# EAGLE design Arduino-Pro-Mini-xkid (EAGLE 7.2.0)
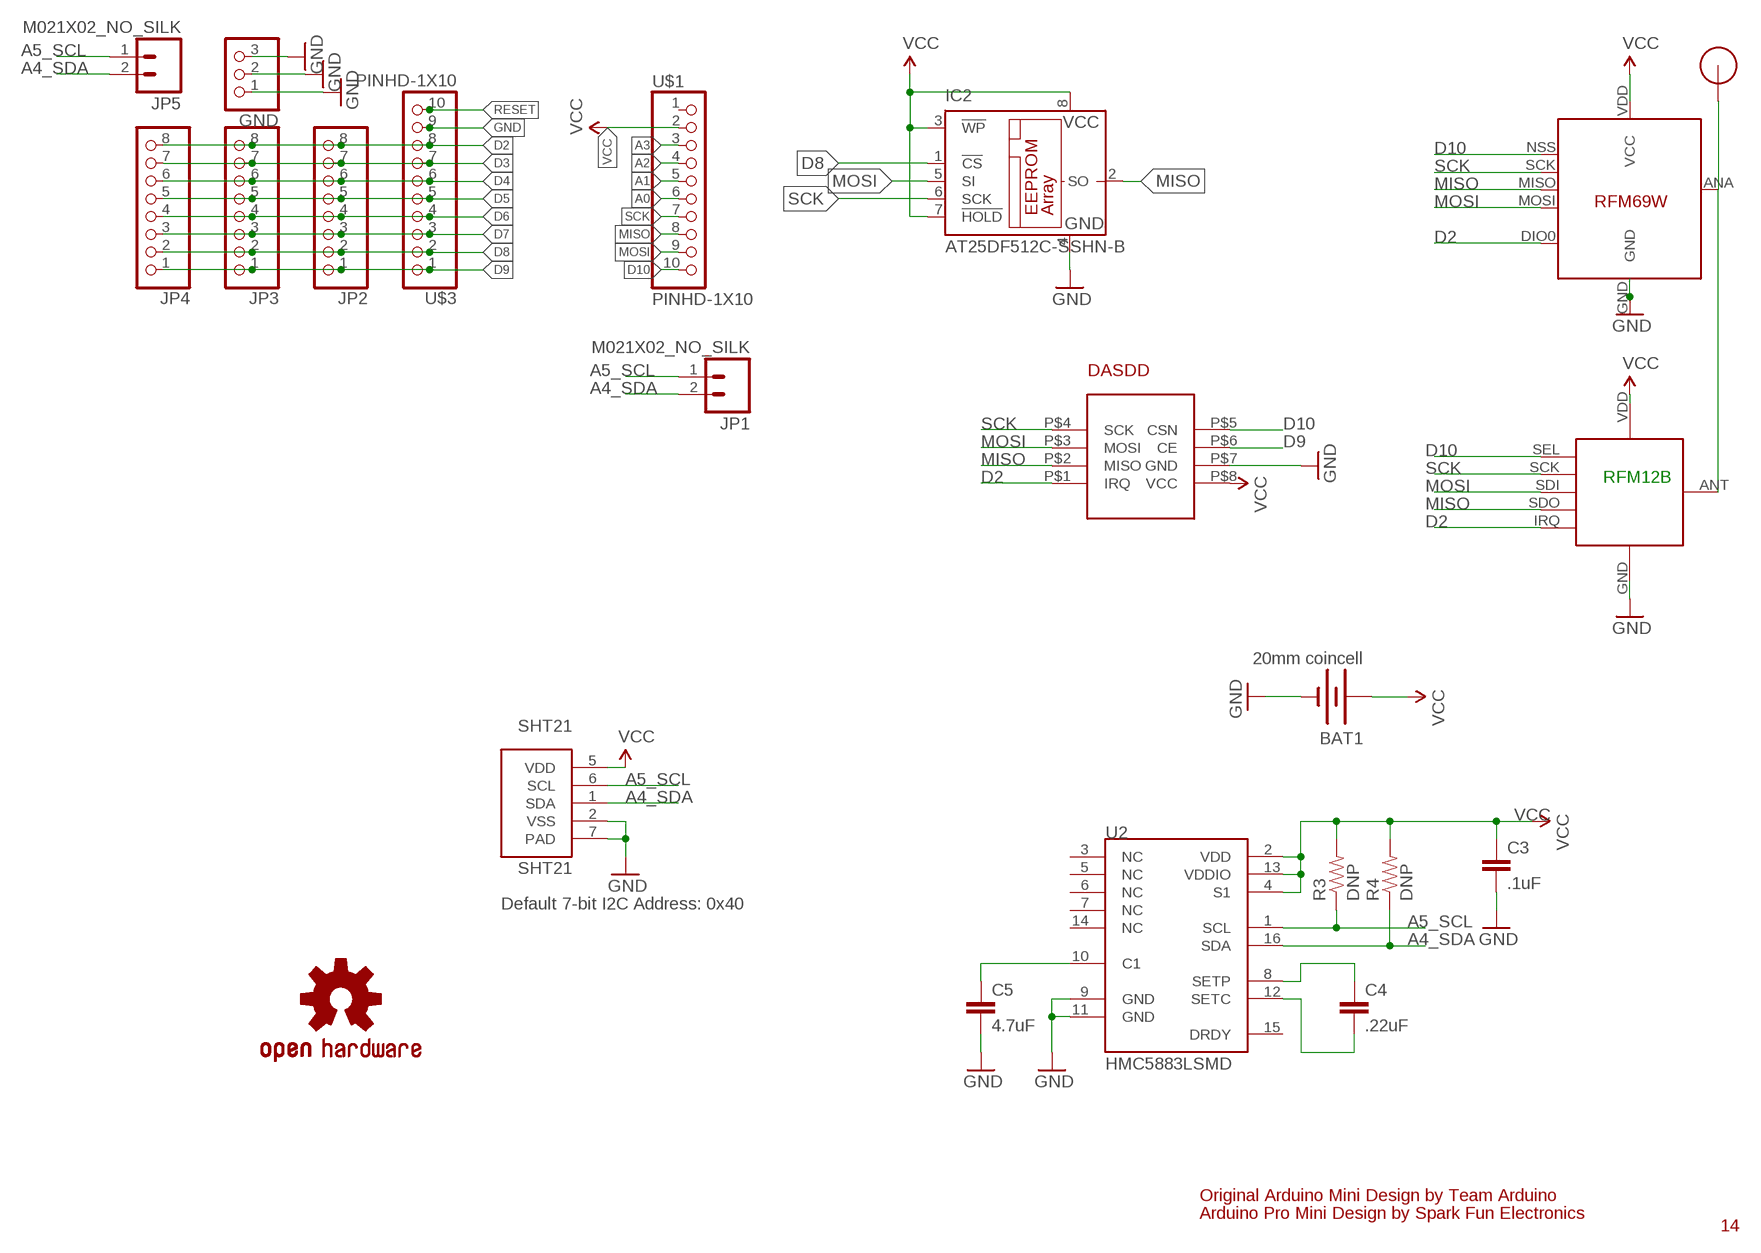
[diagram p0: schematic, sheet 1]

## Parts
BAT1  20mm coincell  BATTERY20MM_4LEGS  [BATTCON_20MM_4LEGS]
C3  .1uF  CAP0603-CAP  [0603-CAP]
C4  .22uF  CAP0603-CAP  [0603-CAP]
C5  4.7uF  CAP0603-CAP  [0603-CAP]
DASDD  NRF24L01+_1.27  [NRF24L01_1.27]
GND  PINHD-1X3  [1X03]
IC2  AT25DF512C-SSHN-B  25AA080SN  [SO-08]
JP1  M021X02_NO_SILK  [1X02_NO_SILK]
JP2  PINHD-1X8CLEANBIG  [1X08-CLEANBIG]
JP3  PINHD-1X8CLEANBIG  [1X08-CLEANBIG]
JP4  PINHD-1X8CLEANBIG  [1X08-CLEANBIG]
JP5  M021X02_NO_SILK  [1X02_NO_SILK]
LOGO1  OSHW-LOGOM  [OSHW-LOGO-M]
R3  DNP  RESISTOR0603-RES  [0603-RES]
R4  DNP  RESISTOR0603-RES  [0603-RES]
RFM12B  RFM12B_MINPADS  [RFM12B-MINPADS]
RFM69W  RFM69  [RFM69W-MINPADS]
SHT21  SHT21  SEN-SENSIRION-SHT2X  [SEN-SENSIRION-SHT2X]
U2  HMC5883LSMD  [16LPCC]
U$1  PINHD-1X10  [1X10-BIG]
U$3  PINHD-1X10  [1X10-BIG]
U$4  RFM12B_ANTENNA  [RFM12B-ANTENNA]

## Nets
A0: U$1.6
A1: U$1.5
A2: U$1.4
A3: U$1.3
A4_SDA: JP1.2 JP5.2 R4.1 SHT21.1(SDA) U2.16(SDA)
A5_SCL: JP1.1 JP5.1 R3.1 SHT21.6(SCL) U2.1(SCL)
D2: DASDD.P$1(IRQ) JP2.8 JP3.8 JP4.8 RFM12B.IRQ RFM69W.DIO0 U$3.8
D3: JP2.7 JP3.7 JP4.7 U$3.7
D4: JP2.6 JP3.6 JP4.6 U$3.6
D5: JP2.5 JP3.5 JP4.5 U$3.5
D6: JP2.4 JP3.4 JP4.4 U$3.4
D7: JP2.3 JP3.3 JP4.3 U$3.3
D8: IC2.1(!CS) JP2.2 JP3.2 JP4.2 U$3.2
D9: DASDD.P$6(CE) JP2.1 JP3.1 JP4.1 U$3.1
D10: DASDD.P$5(CSN) RFM12B.SEL RFM69W.NSS(SEL) U$1.10
GND [power]: BAT1.2(-) C3.2 C5.2 DASDD.P$7(GND) GND.1 GND.2 GND.3 IC2.4(GND) RFM12B.GND RFM69W.GND SHT21.2(VSS) SHT21.7(PAD) U2.9(GND) U2.11(GND) U$3.9
MISO: DASDD.P$2(MISO) IC2.2(SO) RFM12B.SDO(SDO/MISO) RFM69W.MISO U$1.8
MOSI: DASDD.P$3(MOSI) IC2.5(SI) RFM12B.SDI(SDI/MOSI) RFM69W.MOSI U$1.9
N$3: RFM12B.ANT RFM69W.ANA(ANT) U$4.P$1
N$4: C4.1 U2.8(SETP)
N$5: C4.2 U2.12(SETC)
N$6: C5.1 U2.10(C1)
RESET: U$3.10
SCK: DASDD.P$4(SCK) IC2.6(SCK) RFM12B.SCK RFM69W.SCK U$1.7
VCC: BAT1.1(+) C3.1 DASDD.P$8(VCC) IC2.3(!WP) IC2.7(!HOLD) IC2.8(VCC) R3.2 R4.2 RFM12B.VDD RFM69W.VDD(VCC) SHT21.5(VDD) U2.2(VDD) U2.4(S1) U2.13(VDDIO) U$1.2
Unconnected: U2.3(NC) U2.5(NC) U2.6(NC) U2.7(NC) U2.14(NC) U2.15(DRDY) U$1.1

## Notes on the sheet
- RFM12B
- Default 7-bit I2C Address: 0x40
- Original Arduino Mini Design by Team Arduino
- Arduino Pro Mini Design by Spark Fun Electronics
- 14

## Library data of the parts
BAT1 = SparkFun-Electromechanical:BATTERY: Battery Holders Various common sizes : AA, AAA, 18650 (PRT-12895), 20mm coin cell and 12mm coin cell. 20MM_4LEGS, BATT-10373; PROD_ID: BATT-10373
C3-C5 = SparkFun:CAP: Capacitor Standard 0603 ceramic capacitor, and 0.1" leaded capacitor.
DASDD = _xpix:NRF24L01+_1.27
GND = _adafruit:PINHD-1X3: PIN HEADER
IC2 = microchip:25*: Serial EEPROM 4K/ 8K , SPI bus; MF: MICROCHIP; MPN: 25AA080/SN; OC_FARNELL: 1816072; OC_NEWARK: 92C7351
JP1 JP5 = SparkFun-Connectors:M02: Standard 2-pin 0.1" header. Use with - straight break away headers ( PRT-00116) - right angle break away headers (PRT-00553) - swiss pins (PRT-00743) - machine pins (PRT-00117) - female headers (PRT-00115) Molex polarized connector foot print use with: PRT-08233 with associated crimp pins and housings. 2.54_SCREWTERM for use with PRT-10571. 3.5mm Screw Terminal footprints for PRT-08084 5mm Screw Terminal footprints for use with PRT-08432
JP2-JP4 = _adafruit:PINHD-1X8: PIN HEADER
LOGO1 = SparkFun-Aesthetics:OSHW-LOGO: Open Source Hardware Logo This logo indicates the piece of hardware it is found on incorporates a OSHW license and/or adheres to the definition of open source hardware found here: http://freedomdefined.org/OSHW
R3 R4 = SparkFun:RESISTOR: Resistor Basic schematic elements and footprints for 0603, 1206, and PTH resistors.
RFM12B = LowPowerLab:RFM12B_MINPADS
RFM69W = LowPowerLab:RFM69
SHT21 = Misenso:SEN-SENSIRION-SHT2X
U2 = SparkFun:HMC5883L: 3 Axis Digital Compass IC
U$1 U$3 = _adafruit:PINHD-1X10: Pin header 1x10 0.1" spacing With round pins
U$4 = LowPowerLab:RFM12B_ANTENNA

## Net classes
1 power: width 0.152 mm

## Board
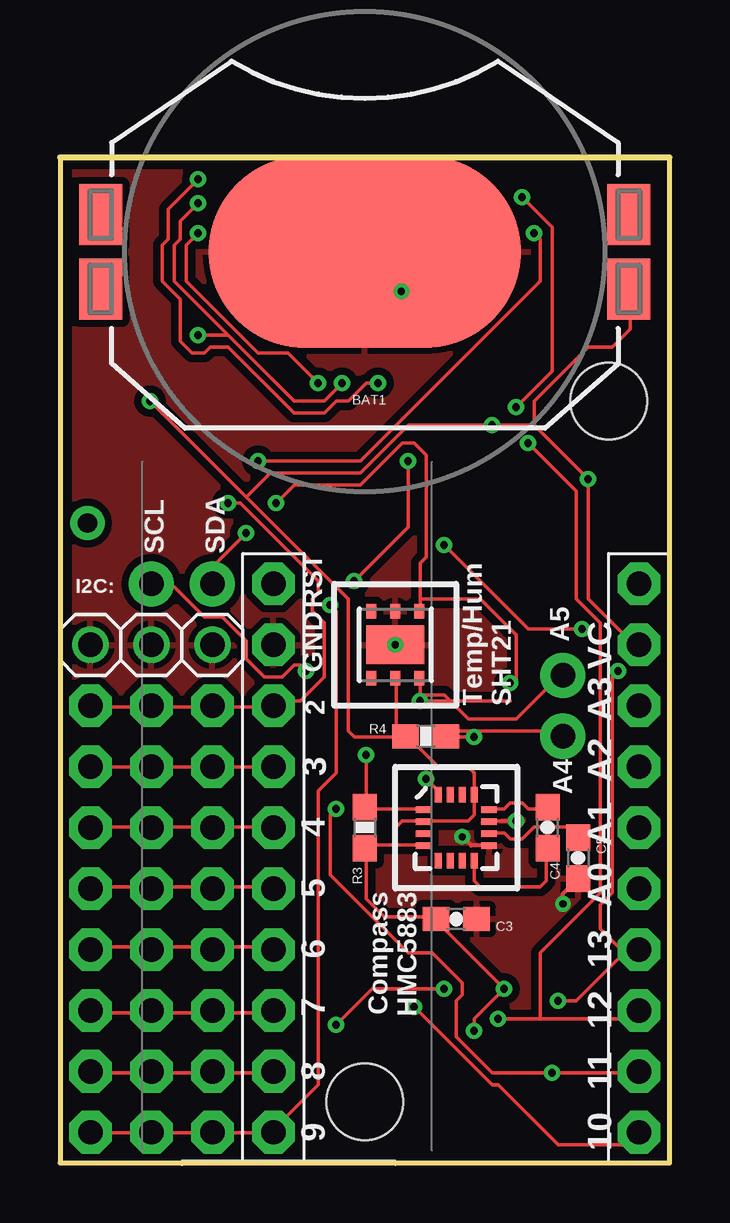
[diagram p1: board, top side]
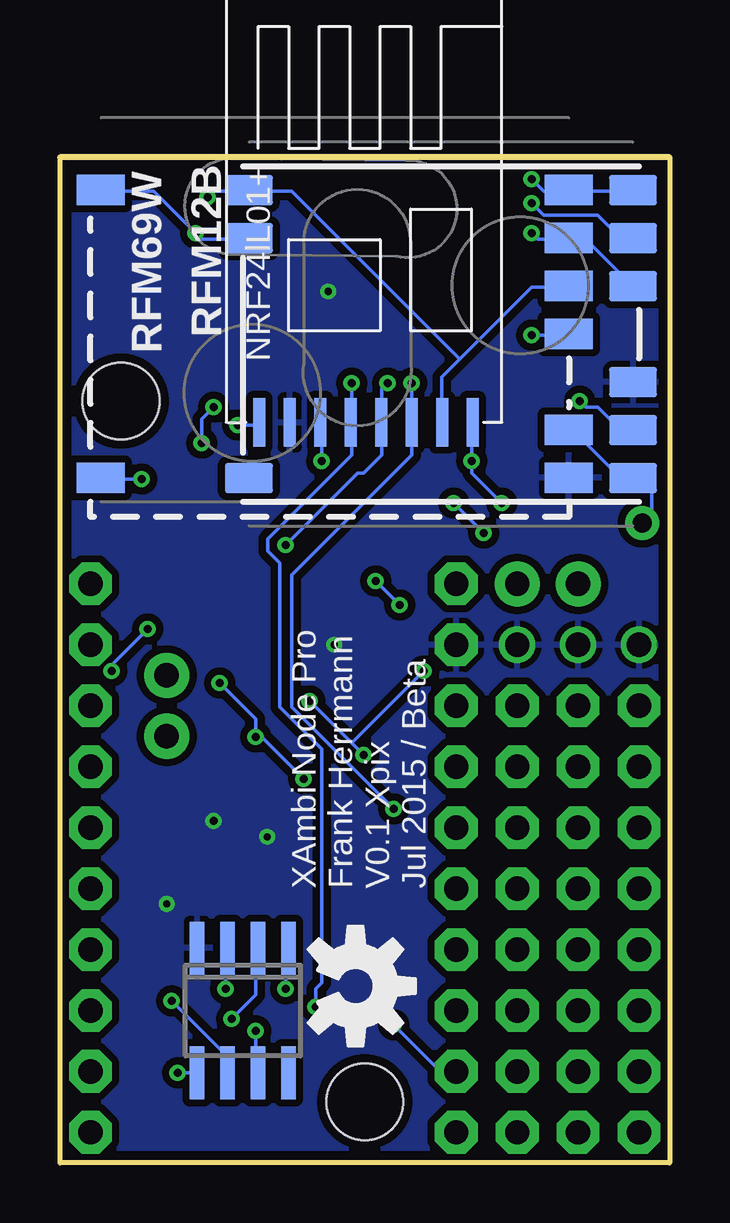
[diagram p2: board, bottom side, seen from below]

Size 25.4 x 41.91 mm. Coordinates in mm from the lower left corner, seen from the top.
Outline: 0,41.91 0,0 25.4,0 25.4,41.91 0,41.91
Copper layers (1*16): Top 0.0356mm / dielectric 1.5011mm / Bottom 0.0356mm
Design rules "oshpark": minimum track width 6mil, minimum drill 13mil, track to track 6mil, track to pad 6mil, pad to pad 6mil, via to via 6mil, smd to smd 6mil, copper to edge 15mil, drill to drill 6mil, minimum pad ring 7mil, minimum via ring 7mil, stop-mask expansion 3mil, vias tented up to drill 0mil, thermal gap 10mil
Holes 3.2 mm at 12.7,2.54 22.86,31.75

### Footprints (pad centres in the part's own frame; a part is rotated, then mirrored left to right if it is on the bottom)
BATTCON_20MM_4LEGS = smd 1.778 x 2.54: 1 -11,1.55; 3 11,1.55; P$1 -11,-1.55; P$2 11,-1.55 | smd 13 x 8: 2 0,0
0603-CAP = smd 1.1 x 1: 1 -0.85,0; 2 0.85,0
NRF24L01_1.27 = smd 2.016 x 0.508: P$1 0,1.219; P$2 0,2.489; P$3 0,3.759; P$4 0,5.029; P$5 0,6.299; P$6 0,7.569; P$7 0,8.839; P$8 0,10.109
1X03 = drill 1.016: 1 -2.54,0; 2 0,0; 3 2.54,0
SO-08 = smd 0.6 x 2.2: 1 -1.905,-2.6; 2 -0.635,-2.6; 3 0.635,-2.6; 4 1.905,-2.6; 5 1.905,2.6; 6 0.635,2.6; 7 -0.635,2.6; 8 -1.905,2.6
1X02_NO_SILK = drill 1.016 pad 1.88: 1 0,0; 2 2.54,0
1X08-CLEANBIG = drill 1.016 pad 1.778 octagon: 1 -8.89,0; 2 -6.35,0; 3 -3.81,0; 4 -1.27,0; 5 1.27,0; 6 3.81,0; 7 6.35,0; 8 8.89,0
0603-RES = smd 1.1 x 1: 1 -0.85,0; 2 0.85,0
RFM12B-MINPADS = smd 2 x 1.27: ANT 8,-6; GND 8,-2; IRQ -8,4; SCK 8,4; SDI 8,2; SDI1 -8.002,-6.001; SDO -8,6; SEL 8,6; VDD 8,-4
RFM69W-MINPADS = smd 2 x 1.27: ANA 8,-5; DIO0 -11.5,5; GND 8,-7; MISO 8,1; MOSI 8,3; NSS 8,5; SCK 8,-1; VDD -11.5,-7
SEN-SENSIRION-SHT2X = smd 0.4 x 0.6: 1 -1,-1.4; 2 0,-1.4; 3 1,-1.4; 4 1,1.4; 5 0,1.4; 6 -1,1.4 | smd 2.4 x 1.6: 7 0,0
16LPCC = smd 0.65 x 0.28: 1 -1.37,0.75; 2 -1.37,0.25; 3 -1.37,-0.25; 4 -1.37,-0.75; 9 1.37,-0.75; 10 1.37,-0.25; 11 1.37,0.25; 12 1.37,0.75 | smd 0.28 x 0.65: 5 -0.75,-1.37; 6 -0.25,-1.37; 7 0.25,-1.37; 8 0.75,-1.37; 13 0.75,1.37; 14 0.25,1.37; 15 -0.25,1.37; 16 -0.75,1.37
1X10-BIG = drill 1.016 pad 1.778 octagon: 1 -11.43,0; 2 -8.89,0; 3 -6.35,0; 4 -3.81,0; 5 -1.27,0; 6 1.27,0; 7 3.81,0; 8 6.35,0; 9 8.89,0; 10 11.43,0
RFM12B-ANTENNA = drill 0.8 pad 1.422: P$1 0,0

### Placement (x,y rotation side)
BAT1  12.7,37.97 180 top
C3  16.51,10.16 0 top
C4  20.32,13.97 90 top
C5  21.59,12.7 270 top
DASDD  6.99,30.86 90 bottom
GND  3.81,21.59 0 top
IC2  17.78,6.35 180 bottom
JP1  20.95,20.32 270 top
JP2  6.35,10.16 90 top
JP3  3.81,10.16 90 top
JP4  1.27,10.16 90 top
JP5  3.81,24.13 0 top
LOGO1  13.08,7.37 270 bottom
R3  12.7,13.97 270 top
R4  15.24,17.78 180 top
RFM12B  9.53,34.54 0 bottom
RFM69W  12.19,35.56 0 bottom
SHT21  13.97,21.59 180 top
U2  16.51,13.97 0 top
U$1  24.13,12.7 270 top
U$3  8.89,12.7 90 top
U$4  1.14,26.67 0 top

### Tracks (layer width: path | path; a pad name or v marks a point on that pad's centre or on a via)
A4_SDA  (via drill 0.33)
  Top 0.152: v15.25,16 15.75,15.5 U2.16 | v17.25,17.75 16.25,17.75 R4.1 16.5,18 20.5,18 JP1.2 | 15,23.5 15,23 SHT21.1 | 15,23.5 17.5,23.5 19,22 19,20 v18.75,20 | v7.75,26.25 6.5,25 6.5,24.25 JP5.2 | v9,27.5 9.75,28.25 12.5,28.25 14.25,30 14.75,30 15.25,29.5 15.25,25.25 15,25 15,23.5
  Bottom 0.152: v15.25,16 17,17.75 v17.25,17.75 17.25,18.5 v18.75,20 | v9,27.5 v7.75,26.25
A5_SCL  (via drill 0.33)
  Top 0.152: U2.1 15,14.75 12.75,14.75 R3.1 12.75,15 v12.75,17 | 15,19.5 15,20 SHT21.6 | 15,19.5 15.25,19.25 18.75,19.25 | v10.25,20.5 10,20.75 9.75,20.75 9.25,20.25 8.5,20.25 7.75,21 7.75,21.75 6.75,22.75 6,22.75 4.75,24 4,24 JP5.1 | 15,19.5 16,19.5 17,18.5 19,18.5 20.5,20 JP1.1 | 15,19.5 v15,19.25
  Bottom 0.152: v15,19.25 13.25,17.5 | 13.25,17.5 v12.75,17 | 13.25,17.5 v10.25,20.5
D2  (via drill 0.33)
  Top 0.152: JP4.8 1.5,19 3.75,19 JP3.8 4,19 6.25,19 JP2.8 6.5,19 8.75,19 U$3.8 9,19.25 10,19.25 11,20.25 11,22.5 10.5,23 10.5,23.5 10.75,23.75 10.75,24.25 7.5,27.5 v7,27.5 | v19.75,38.75 20,38.5 20,36.75 12.5,29.25 v8.25,29.25
  Bottom 0.152: RFM12B.IRQ 17.75,38.5 19.5,38.5 v19.75,38.75 21.5,40.5 23.5,40.5 RFM69W.DIO0 | v7,27.5 8.25,28.75 v8.25,29.25 8.25,30.75 DASDD.P$1
D3
  Top 0.152: JP4.7 1.5,16.5 3.75,16.5 JP3.7 4,16.5 6.25,16.5 JP2.7 6.5,16.5 8.75,16.5 U$3.7
D4
  Top 0.152: JP4.6 1.5,14 3.75,14 JP3.6 4,14 6.25,14 JP2.6 6.5,14 8.75,14 U$3.6
D5
  Top 0.152: JP4.5 1.5,11.5 3.75,11.5 JP3.5 4,11.5 6.25,11.5 JP2.5 6.5,11.5 8.75,11.5 U$3.5
D6
  Top 0.152: JP4.4 1.5,9 3.75,9 JP3.4 4,9 6.25,9 JP2.4 6.5,9 8.75,9 U$3.4
D7
  Top 0.152: JP4.3 1.5,6.25 3.75,6.25 JP3.3 4,6.25 6.25,6.25 JP2.3 6.5,6.25 8.75,6.25 U$3.3
D8  (via drill 0.33)
  Top 0.152: JP4.2 1.5,3.75 3.75,3.75 JP3.2 4,3.75 6.25,3.75 JP2.2 6.5,3.75 8.75,3.75 U$3.2 | v16,7.25 13,7.25 v11.5,5.75
  Bottom 0.152: v16,7.25 16,8.75 IC2.1 | v11.5,5.75 9.75,4 9,4 U$3.2
D9  (via drill 0.33)
  Top 0.152: JP4.1 1.5,1.25 3.75,1.25 JP3.1 4,1.25 6.25,1.25 JP2.1 6.5,1.25 8.75,1.25 U$3.1 9,1.5 10.75,3.25 10.75,15.5 11.5,16.25 11.5,23 v11.25,23.25 | v14.5,29.25 14.5,26.5 v12.25,24.25
  Bottom 0.152: v14.5,29.25 14.5,30.75 DASDD.P$6 | v11.25,23.25 v12.25,24.25
D10  (via drill 0.33)
  Top 0.152: v13.25,32.5 12.75,32.5 12,31.75 11.5,31.75 11,31.25 9.75,31.25 7,34 6.25,34 6,33.75 5.5,33.75 5,34.25 5,36 4.25,36.75 4.25,38.25 4.5,38.5 4.5,39.75 v5.75,41 | v14.75,6.5 18,3.25 18.25,3.25 20.75,0.75 23.5,0.75 24,1.25 U$1.10
  Bottom 0.152: RFM12B.SEL 1.75,40.5 4,40.5 RFM69W.NSS 4.25,40.5 5.25,40.5 v5.75,41 | v13.25,32.5 13.25,31 DASDD.P$5 13.25,30.75 13.25,29.5 16.75,26 16.75,25.5 16.25,25 16.25,19 14.5,17.25 14.5,7.5 14.75,7.25 v14.75,6.5
GND  (via drill 0.3, 0.33)
  Top 0.152: v19,14.25 18,14.25 U2.11
  Top 0.16: v14.22,36.32 14.22,36.45 BAT1.2 | v20.95,10.79 20.95,11.21 C5.2 | U2.9 17.13,13.22 v16.76,13.59
  other vias: 13.97,21.59
  pour Top (isolate 0.305): 0,41.91 25.4,41.91 25.4,0 0,0
  pour Bottom (isolate 0.305): 0,41.91 25.4,41.91 25.4,0 0,0
MISO  (via drill 0.33)
  Top 0.152: 20,6 23.75,6 24,6.25 U$1.8 | 20,6 v18.25,6 | 20,6 20,8.75 22.5,11.25 22.5,22.5 21.5,23.5 21.5,28 v19.5,30 | v19,31.5 20.5,33 20.5,39 v19.25,40.25
  Bottom 0.152: v18.25,6 17.25,7 17.25,8.75 IC2.2 | 8.75,33.5 9.5,32.75 9.5,31 DASDD.P$2 | 8.75,33.5 5.75,36.5 4.25,36.5 RFM69W.MISO | 8.75,33.5 15.75,40.5 17.5,40.5 RFM12B.SDO 17.75,40.5 19,40.5 v19.25,40.25 | v19.5,30 19.5,31 v19,31.5
MOSI  (via drill 0.33)
  Top 0.152: U$1.9 24,3.75 v20.5,3.75 18,3.75 16.5,5.25 16.5,6.75 16.75,7 16.75,7.5 15.5,8.75 14.5,8.75 11.25,12 11.25,14.5 v11.5,14.75 | v10.75,32.5 9.5,33.75 8.25,33.75 5.25,36.75 5.25,38.25 v5.75,38.75
  Bottom 0.152: v20.5,3.75 IC2.5 | RFM12B.SDI 1.75,36.75 3.5,38.5 4,38.5 RFM69W.MOSI 4.25,38.5 5.5,38.5 v5.75,38.75 | v10.75,32.5 10.75,31 DASDD.P$3 10.75,30.75 10.75,29.5 15.75,24.5 15.75,19 v11.5,14.75
N$3
  Bottom 0.152: U$4.P$1 1,26.75 0.75,27 0.75,28.5 1.5,28.5 RFM12B.ANT 1.75,28.5 2,28.5 4,30.5 RFM69W.ANA
N$4
  Top 0.152: U2.8 17.25,12.5 17.25,11.75 17.5,11.5 20,11.5 20.25,11.75 20.25,13 C4.1
N$5
  Top 0.152: U2.12 18,14.75 18.5,14.75 18.75,15 19.25,15 19.5,14.75 20.25,14.75 C4.2
N$6
  Top 0.152: U2.10 18,13.75 18.5,13.75 18.75,13.5 19.25,13.5 19.75,14 21.5,14 21.75,13.75 C5.1
SCK  (via drill 0.33)
  Top 0.152: v20.75,6.75 21.5,6.75 23.5,8.75 | 23.5,8.75 24,8.75 U$1.7 23.5,8.75 | 7,34.5 v5.75,34.5 | 7,34.5 9.75,31.75 11,31.75 v11.75,32.5 | v5.75,40 5,39.25 5,38.5 4.75,38.25 4.75,36.75 7,34.5 | 23.5,8.75 22.5,9.75 22.5,10.75 23,11.25 23,20.25 v23.25,20.5 | v21.75,22.25 19.5,22.25 v16,25.75
  Bottom 0.152: v20.75,6.75 18.5,4.5 18.5,3.75 IC2.6 | v5.75,34.5 4.25,34.5 RFM69W.SCK | v11.75,32.5 12,32.25 12,31 DASDD.P$4 12,30.75 12,29.5 12.75,28.75 13,28.75 v16,25.75 | v5.75,40 5.25,39.5 3,39.5 2.25,38.75 1.75,38.75 RFM12B.SCK | v23.25,20.5 23.25,20.75 v21.75,22.25
VCC  (via drill 0.33)
  Top 0.152: U$1.2 24,21.5 22,23.5 v22,28.5 19.75,30.75 | 19.75,30.75 v18,30.75 14.5,30.75 12.5,28.75 8.75,28.75 7.75,27.75 | 19.75,30.75 19.75,31.75 22,34 23,34 23.75,34.75 23.75,36.25 BAT1.1 | SHT21.5 14,20 14,18.25 14.25,18 R4.2 | 14,13.25 12.75,13.25 R3.2 12.75,13 12.75,11 13.5,10.25 15.5,10.25 C3.1 15.75,10 v18.5,7.25 17.25,6 v17.25,5.5 | 14,13.25 15,13.25 U2.4 | 14,13.25 14,14 14.25,14.25 15,14.25 U2.2 15.25,14.25 17,14.25 17.25,14.5 17.25,15.25 U2.13 17.25,15.5 17.25,16.25 17,16.5 15.75,16.5 14.5,17.75 R4.2 | 7.75,27.75 12,23.5 12,18 12.25,17.75 14.25,17.75 R4.2 | 7.75,27.75 v3.75,31.75
  Bottom 0.152: v22,28.5 23.5,28.5 RFM69W.VDD | v18,30.75 17.25,30.75 DASDD.P$8 | 17.25,4.5 16,4.5 16,3.75 IC2.8 | 17.25,4.5 17.25,3.75 IC2.7 17.25,4.5 | v3.75,31.75 3.5,31.5 3,31.5 2.25,30.75 1.75,30.75 RFM12B.VDD | v18.5,7.25 18.5,8.75 IC2.3 | v17.25,5.5 17.25,4.5

### Text on the board
tPlace: SCL | SDA | I2C: | RST | A5 | VC | GND | 2 | Temp/Hum / SHT21 | A3 | 3 | A2 | A4 | 4 | A1 | 5 | Compass / HMC5883 | A0 | 6 | 13 | 7 | 12 | 8 | 11 | 9 | 10
bNames: XAmbi Node Pro / Frank Herrmann / V0.1 Xpix / Jul 2015 / Beta
tDocu: * Remove Temp and magnet Sensor / * Special Row for I2C (VDD,SDA,SDC,GND) / * Add booster for 5V / * Add Solarloader for SuperCAP